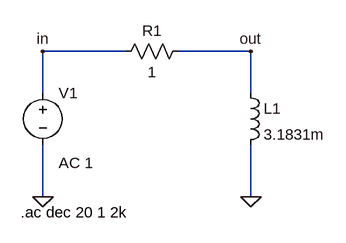
[diagram p0: schematic RL_highpass Filter.asc]
RL_highpass Filter.asc, the LTspice schematic file:
Version 4
SHEET 1 880 680
WIRE 224 48 96 48
WIRE 416 48 304 48
WIRE 96 112 96 48
WIRE 416 112 416 48
WIRE 96 272 96 192
WIRE 416 272 416 192
FLAG 96 272 0
FLAG 416 272 0
FLAG 416 48 out
FLAG 96 48 in
SYMBOL voltage 96 96 R0
WINDOW 123 24 124 Left 2
WINDOW 39 0 0 Left 0
SYMATTR InstName V1
SYMATTR Value ""
SYMATTR Value2 AC 1
SYMBOL res 320 32 R90
WINDOW 0 0 56 VBottom 2
WINDOW 3 32 56 VTop 2
SYMATTR InstName R1
SYMATTR Value 1
SYMBOL ind 400 96 R0
SYMATTR InstName L1
SYMATTR Value 3.1831m
TEXT 62 296 Left 2 !.ac dec 20 1 2k

The netlist it stands for:
* RL_highpass Filter.asc
V1 in 0 AC 1
R1 out in 1
L1 out 0 3.1831m
.ac dec 20 1 2k
.backanno
.end